# Altium schematic sheet Camera.SchDoc
size A
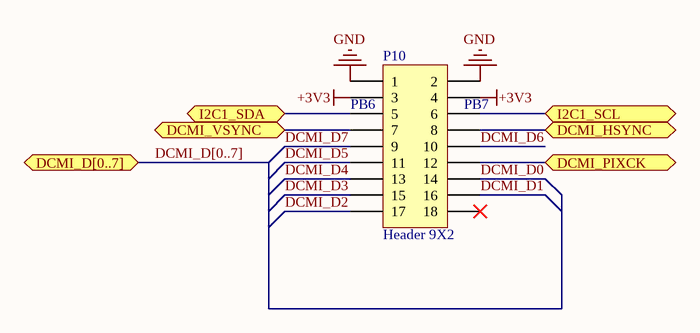
[diagram p0: Camera.SchDoc]

## Parts
P10  Header 9X2  [HDR2X9]

## Ports
DCMI_D[0..7], DCMI_HSYNC, DCMI_PIXCK, DCMI_VSYNC, I2C1_SCL, I2C1_SDA

## Nets
+3V3: P10.3 P10.4
GND: P10.1 P10.2
DCMI_D0: P10.14
DCMI_D1: P10.16
DCMI_D2: P10.17
DCMI_D3: P10.15
DCMI_D4: P10.13
DCMI_D5: P10.11
DCMI_D6: P10.10
DCMI_D7: P10.9
DCMI_HSYNC: P10.8 ; port DCMI_HSYNC
DCMI_PIXCK: P10.12 ; port DCMI_PIXCK
DCMI_VSYNC: P10.7 ; port DCMI_VSYNC
I2C1_SCL: P10.6 ; port I2C1_SCL
I2C1_SDA: P10.5 ; port I2C1_SDA

Not connected (* = marked no-connect by the designer): P10 18*

## Buses and harness runs
bus DCMI_D[0..7] = port DCMI_D[0..7]

## Notes on the sheet
- (near P10) PB6
- (near P10) PB7

## Library data of the parts
P10 = Header 9X2: Header, 9-Pin, Dual row; LatestRevisionDate: 17-Jul-2002; LatestRevisionNote: Re-released for DXP Platform.; Publisher: Altium Limited